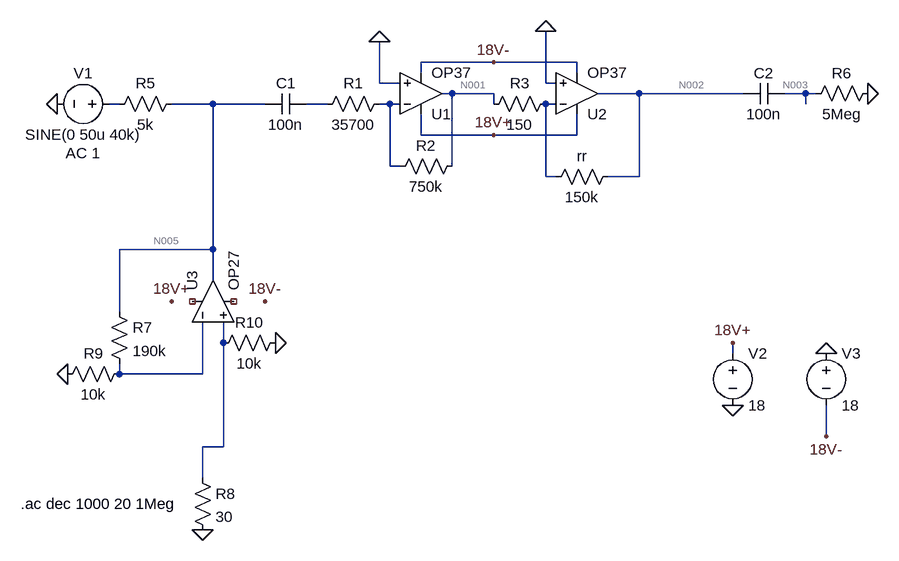
[diagram p0: schematic preamp.asc]
preamp.asc, the LTspice schematic file:
Version 4
SHEET 1 1012 772
WIRE 416 32 304 32
WIRE 544 32 416 32
WIRE 304 48 304 32
WIRE 544 48 544 32
WIRE 240 64 240 0
WIRE 272 64 240 64
WIRE 496 64 496 -16
WIRE 512 64 496 64
WIRE 352 80 336 80
WIRE 416 80 352 80
WIRE 640 80 576 80
WIRE 800 80 640 80
WIRE 896 80 864 80
WIRE 912 80 896 80
WIRE -160 96 -176 96
WIRE -16 96 -80 96
WIRE 64 96 -16 96
WIRE 160 96 128 96
WIRE 256 96 240 96
WIRE 272 96 256 96
WIRE 416 96 416 80
WIRE 512 96 496 96
WIRE 896 96 896 80
WIRE 304 144 304 112
WIRE 416 144 304 144
WIRE 544 144 544 112
WIRE 544 144 416 144
WIRE 256 192 256 96
WIRE 272 192 256 192
WIRE 352 192 352 80
WIRE 496 208 496 96
WIRE 512 208 496 208
WIRE 640 208 640 80
WIRE 640 208 592 208
WIRE -16 320 -16 96
WIRE -16 320 -160 320
WIRE -16 368 -16 320
WIRE -160 416 -160 320
WIRE 0 464 0 432
WIRE 784 480 784 464
WIRE -160 512 -160 496
WIRE -32 512 -32 432
WIRE -32 512 -160 512
WIRE 928 608 928 560
WIRE 0 624 0 464
WIRE 0 624 -32 624
WIRE -32 672 -32 624
FLAG 784 560 0
FLAG 928 480 0
FLAG 784 464 18V+
FLAG -80 400 18V+
FLAG 416 32 18V-
FLAG 64 400 18V-
FLAG 416 144 18V+
FLAG 928 608 18V-
FLAG -256 96 0
FLAG 496 -16 0
FLAG 240 0 0
FLAG -32 752 0
FLAG -240 512 0
FLAG 80 464 0
FLAG 992 80 0
SYMBOL OpAmps\\OP37 304 144 M180
SYMATTR InstName U1
SYMBOL OpAmps\\OP37 544 144 M180
SYMATTR InstName U2
SYMBOL voltage -160 96 R90
WINDOW 0 -32 56 VBottom 2
WINDOW 3 32 56 VTop 2
WINDOW 123 60 56 VTop 2
WINDOW 39 0 0 Left 0
SYMATTR InstName V1
SYMATTR Value SINE(0 50u 40k)
SYMATTR Value2 AC 1
SYMBOL voltage 784 464 R0
WINDOW 123 0 0 Left 0
WINDOW 39 0 0 Left 0
SYMATTR InstName V2
SYMATTR Value 18
SYMBOL voltage 928 464 R0
WINDOW 123 0 0 Left 0
WINDOW 39 0 0 Left 0
SYMATTR InstName V3
SYMATTR Value 18
SYMBOL res 256 80 R90
WINDOW 0 0 56 VBottom 2
WINDOW 3 32 56 VTop 2
SYMATTR InstName R1
SYMATTR Value 35700
SYMBOL res 368 176 R90
WINDOW 0 0 56 VBottom 2
WINDOW 3 32 56 VTop 2
SYMATTR InstName R2
SYMATTR Value 750k
SYMBOL res 512 80 R90
WINDOW 0 0 56 VBottom 2
WINDOW 3 32 56 VTop 2
SYMATTR InstName R3
SYMATTR Value 150
SYMBOL res 608 192 R90
WINDOW 0 0 56 VBottom 2
WINDOW 3 32 56 VTop 2
SYMATTR InstName rr
SYMATTR Value 150k
SYMBOL res -64 80 R90
WINDOW 0 0 56 VBottom 2
WINDOW 3 32 56 VTop 2
SYMATTR InstName R5
SYMATTR Value 5k
SYMBOL OpAmps\\OP27 -80 400 R270
SYMATTR InstName U3
SYMBOL res -176 400 R0
SYMATTR InstName R7
SYMATTR Value 190k
SYMBOL res -48 656 R0
SYMATTR InstName R8
SYMATTR Value 30
SYMBOL res -144 496 R90
WINDOW 0 0 56 VBottom 2
WINDOW 3 32 56 VTop 2
SYMATTR InstName R9
SYMATTR Value 10k
SYMBOL res 96 448 R90
WINDOW 0 0 56 VBottom 2
WINDOW 3 32 56 VTop 2
SYMATTR InstName R10
SYMATTR Value 10k
SYMBOL cap 128 80 R90
WINDOW 0 0 32 VBottom 2
WINDOW 3 32 32 VTop 2
SYMATTR InstName C1
SYMATTR Value 100n
SYMBOL res 1008 64 R90
WINDOW 0 0 56 VBottom 2
WINDOW 3 32 56 VTop 2
SYMATTR InstName R6
SYMATTR Value 5Meg
SYMBOL cap 864 64 R90
WINDOW 0 0 32 VBottom 2
WINDOW 3 32 32 VTop 2
SYMATTR InstName C2
SYMATTR Value 100n
TEXT -312 712 Left 2 !.ac dec 1000 20 1Meg

The netlist it stands for:
* preamp.asc
XU1 0 N007 18V+ 18V- N001 LT1037  ; OP37, pins In+ In- V+ V- OUT
XU2 0 N008 18V+ 18V- N002 LT1037  ; OP37, pins In+ In- V+ V- OUT
V1 N004 0 SINE(0 50u 40k) AC 1
V2 18V+ 0 18
V3 0 18V- 18
R1 N007 N006 35700
R2 N001 N007 750k
R3 N008 N001 150
rr N002 N008 150k
R5 N005 N004 5k
XU3 N009 N010 NC_01 NC_02 N005 OP27  ; pins In+ In- V+ V- OUT
R7 N005 N010 190k
R8 N009 0 30
R9 N010 0 10k
R10 0 N009 10k
C1 N006 N005 100n
R6 0 N003 5Meg
C2 N003 N002 100n
.ac dec 1000 20 1Meg
.lib LTC.lib
.lib ADI.lib
.backanno
.end

* Results of the author's LTspice run, read from the files saved beside the schematic
* Operating Point, zero values left out:
*   V(18v+) = 18 V
*   V(18v-) = -18 V
*   I(V3) = -6.235 mA
*   I(V2) = -6.235 mA
*   Ix(u1:3) = 3.118 mA
*   Ix(u1:4) = -3.118 mA
*   Ix(u2:3) = 3.118 mA
*   Ix(u2:4) = -3.118 mA
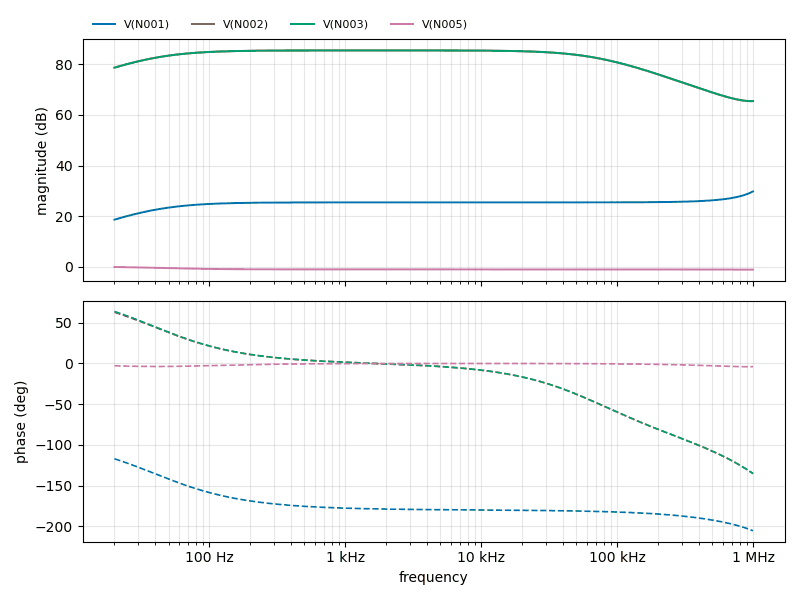
[diagram p1: AC Analysis of preamp.asc, plotted from the saved traces]
* AC Analysis, 1 run:
*   V(N001): 18.68 dB at 20 Hz, 29.83 dB at 1 MHz, peak 29.83 dB at 1 MHz, 3 dB below the peak at 623.6 kHz
*   V(N002): 78.68 dB at 20 Hz, 65.48 dB at 1 MHz, peak 85.49 dB at 1.664 kHz, 3 dB below the peak at 38.94 Hz and 71.13 kHz
*   V(N003): 78.68 dB at 20 Hz, 65.48 dB at 1 MHz, peak 85.49 dB at 1.664 kHz, 3 dB below the peak at 38.95 Hz and 71.13 kHz
*   V(N005): -0.01 dB at 20 Hz, -1.07 dB at 1 MHz, peak -0.01 dB at 20 Hz